# Altium schematic sheet 2002_ESP32.SchDoc
size A3; Author: Joao Marques Chaves; Organization: ETML-ES; Address1: Avenue Recordon 1; Address2: 1004 Lausanne; Address3: Switzerland; SheetNumber: 2; SheetTotal: 7; Version: C
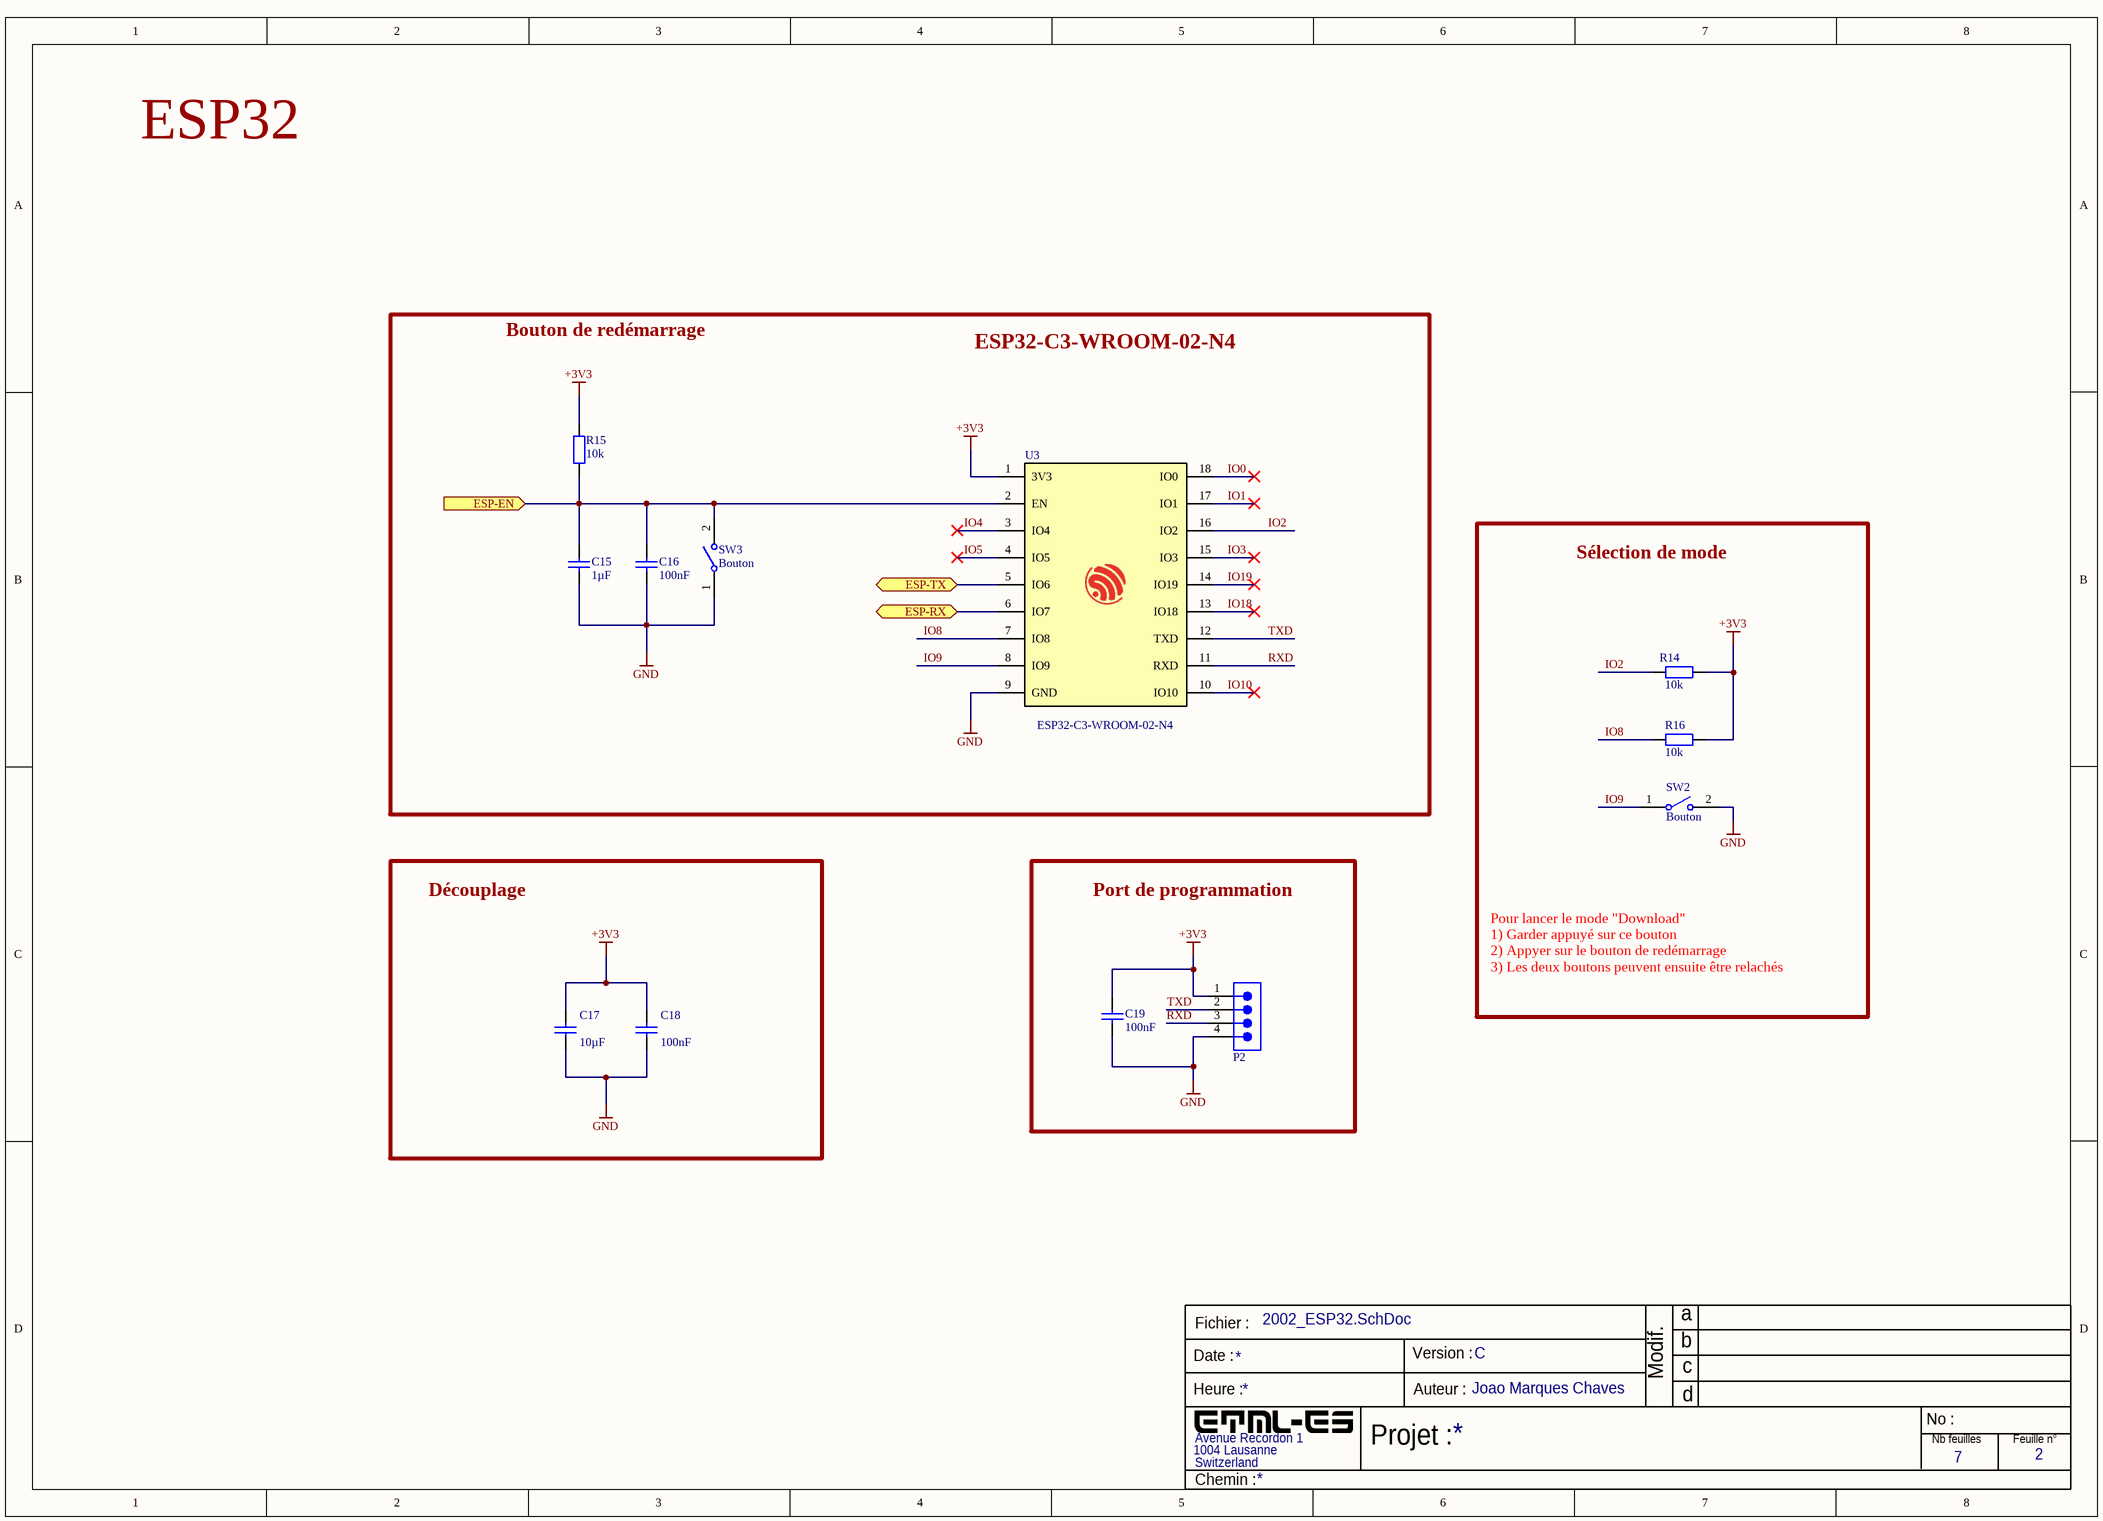
[diagram p0: 2002_ESP32.SchDoc]

## Parts
C15  Capacitance: 1µF  [0805]  (hidden comment: 1uF)
C16  100nF  [0805]
C17  Capacitance: 10µF  [0805]  (hidden comment: 10uF)
C18  Capacitance: 100nF  [0805]  (hidden comment: 100nF16)
C19  100nF  [0805]
P2  4 pin header  [1x4]  (value not drawn)
R14  10k  [0805]
R15  10k  [0805]
R16  10k  [0805]
SW2  Bouton  [Switch]
SW3  Bouton  [Switch]
U3  ESP32-C3-WROOM-02-N4  [MODULE_ESP32-C3-WROOM-02-H4]

## Blocks framed on the sheet
ESP32-C3-WROOM-02-N4: C15 C16 R15 SW3 U3
Sélection de mode: R14 R16 SW2
Découplage: C17 C18
Port de programmation: C19 P2

## Ports
ESP-EN (in), ESP-RX (bidir), ESP-TX (bidir)

## Nets
+3V3: C17.2 C18.2 C19.2 P2.1 R14.1 R15.1 R16.2 U3.1(3V3)
GND: C15.1 C16.2 C17.1 C18.1 C19.1 P2.4 SW2.2 SW3.1 U3.9(GND)
ESP-EN: C15.2 C16.1 R15.2 SW3.2 U3.2(EN) ; port ESP-EN
ESP-RX: U3.6(IO7) ; port ESP-RX
ESP-TX: U3.5(IO6) ; port ESP-TX
IO0: U3.18(IO0)
IO1: U3.17(IO1)
IO2: R14.2 U3.16(IO2)
IO3: U3.15(IO3)
IO4: U3.3(IO4)
IO5: U3.4(IO5)
IO8: R16.1 U3.7(IO8)
IO9: SW2.1 U3.8(IO9)
IO10: U3.10(IO10)
IO18: U3.13(IO18)
IO19: U3.14(IO19)
RXD: P2.3 U3.11(RXD)
TXD: P2.2 U3.12(TXD)

## Notes on the sheet
- ESP32
- Bouton de redémarrage
- Pour lancer le mode "Download"
  1) Garder appuyé sur ce bouton
  2) Appyer sur le bouton de redémarrage
  3) Les deux boutons peuvent ensuite être relachés
- Fichier :
- a
- Date :
- Heure :
- Version :
- Auteur :
- Modif.
- b
- c
- d
- Projet :
- No :
- Nb feuilles
- Feuille n°
- Chemin :

## Library data of the parts
C15 = 885012207022: Capacitor smd; Manufacturer: Wurth Elektronik; Match Code: WCAP-CSGP; Capacitance Tolerance: +/-10%; Ceramic Type: X7R; Dissipation Factor: 5%; Insulation Resistance: 0.5GΩ; Rated Voltage (DC): 10V; Technical Reference: X7R0805105K010DFCT10000; Manufacturer Part Number: 885012207022; Category: Multilayer Ceramic Chip Capacitors; ComponentLink1Description: Website Link; ComponentLink1URL: https://www.we-online.com/redexpert/article/885012207022?ad; ComponentLink2Description: Datasheet Link; ComponentLink2URL: https://www.we-online.com/redexpert/spec/885012207022?ad; Mount: Surface Mount; Operating Temperature Max: 125°C; Operating Temperature Min: -55°C; Packaging: Tape and Reel; Case/Size Code: 0805; Length: 2mm; Width: 1.25mm; Height: 1.25mm
C16 C18 C19 = 885012207016: Capacitor smd; Manufacturer: Wurth Elektronik; Match Code: WCAP-CSGP; Capacitance Tolerance: +/-10%; Ceramic Type: X7R; Dissipation Factor: 5%; Insulation Resistance: 5GΩ; Rated Voltage (DC): 10V; Technical Reference: X7R0805104K010DFCT10000; Manufacturer Part Number: 885012207016; Category: Multilayer Ceramic Chip Capacitors; ComponentLink1Description: Website Link; ComponentLink1URL: https://www.we-online.com/redexpert/article/885012207016?ad; ComponentLink2Description: Datasheet Link; ComponentLink2URL: https://www.we-online.com/redexpert/spec/885012207016?ad; Mount: Surface Mount; Operating Temperature Max: 125°C; Operating Temperature Min: -55°C; Packaging: Tape and Reel; Case/Size Code: 0805; Length: 2mm; Width: 1.25mm; Height: 0.8mm
  C16 C19: Capacitance: 100nF
C17 = 885012107004: Capacitor smd; Manufacturer: Wurth Elektronik; Match Code: WCAP-CSGP; Capacitance Tolerance: +/-20%; Ceramic Type: X5R; Dissipation Factor: 15%; Insulation Resistance: 0.01GΩ; Rated Voltage (DC): 6.3V; Technical Reference: X5R0805106M6R3DFCT10000; Manufacturer Part Number: 885012107004; Category: Multilayer Ceramic Chip Capacitors; ComponentLink1Description: Website Link; ComponentLink1URL: https://www.we-online.com/redexpert/article/885012107004?ad; ComponentLink2Description: Datasheet Link; ComponentLink2URL: https://www.we-online.com/redexpert/spec/885012107004?ad; Mount: Surface Mount; Operating Temperature Max: 85°C; Operating Temperature Min: -55°C; Packaging: Tape and Reel; Case/Size Code: 0805; Length: 2mm; Width: 1.25mm; Height: 1.25mm
P2 = 61300411121: WR-PHD Pin Header, THT, Vertical, pitch 2.54mm, 1 Row, 4P; Manufacturer: Wurth Elektronik; Contact Resistance: 20mΩ; Rated Current: 3A; Working Voltage: 250V; Withstanding Voltage: 500V; ComponentLink1Description: distributeur; ComponentLink1URL: https://eu.mouser.com/ProductDetail/Wurth-Elektronik/61300411121?qs=PhR8RmCirEYQcLLqXD8rAA%3D%3D; ComponentLink2Description: Datasheet; ComponentLink2URL: https://www.we-online.com/components/products/datasheet/61300411121.pdf; Manufacturer Part Number: 61300411121; Category: Board-to-Board Connectors; Match Code: WR-PHD; Mount: Through Hole; Operating Temperature Max: 105°C; Operating Temperature Min: -40°C; Packaging: Bag; Gender: Pin Header; Number of Pins: 4; Number of Rows: 1; Orientation: Vertical; Pitch: 2.54mm
R14-R16 = RES-0805: SMD Resistor; Resistance: 10k
SW2 SW3 = 434121050836: Tactile Switches WS-TASV Tact Switch; Manufacturer: Wurth Elektronik; Circuit: SPST-NO; Operation Force: 360g; Rated Current: 50mA; Rated Voltage (DC): 12V; Washable: No; Manufacturer Part Number: 434121050836; Category: Tact Switches; Match Code: WS-TASV; ComponentLink1Description: Website Link; ComponentLink1URL: https://www.we-online.com/redexpert/article/434121050836?ad; ComponentLink2Description: Datasheet Link; ComponentLink2URL: https://www.we-online.com/redexpert/spec/434121050836?ad; Mount: Surface Mount; Operating Temperature Max: 85°C; Operating Temperature Min: -40°C; Packaging: Tape and Reel; Length: 6mm; Width: 3.5mm; Height: 5mm; Contact Material: Stainless Steel; Contact Plating: Silver; Terminal Material: Copper Alloy; Terminal Plating: Silver; ComponentLink3Description: distributeur; ComponentLink3URL: https://eu.mouser.com/ProductDetail/Wurth-Elektronik/434121050836?qs=wr8lucFkNMVxMSmJWja3%2Fg%3D%3D; ComponentLink4Description: Datasheet; ComponentLink4URL: https://www.we-online.com/components/products/datasheet/434121050836.pdf
U3 = ESP32-C3-WROOM-02-N4: WiFi Modules (802.11) (Engineering Samples) SMD module, ESP32-C3, 4MB SPI flash, PCB antenna, -40 C +85 C; Manufacturer_Name: Espressif Systems; Geometry.Height: 3.35mm; Manufacturer_Part_Number: ESP32-C3-WROOM-02-N4; Mouser Part Number: 356-ESP32C3WROOM02N4; distributeur: https://www.mouser.co.uk/ProductDetail/Espressif-Systems/ESP32-C3-WROOM-02-N4?qs=stqOd1AaK7%2FqjTZKEOgfUg%3D%3D; Arrow Part Number: *; Arrow Price/Stock: *; Datasheet Link: https://www.mouser.ch/datasheet/2/891/Espressif_ESP32_C3_WROOM_02-2006871.pdf; ComponentLink1Description: Datasheet; ComponentLink1URL: https://www.mouser.ch/datasheet/2/891/Espressif_Systems_04082021_ESP32_C3_WROOM_02-2295851.pdf